# Altium schematic sheet Sheet1.SchDoc
size 1016 x 508 mm; SheetNumber: 1; SheetTotal: 1
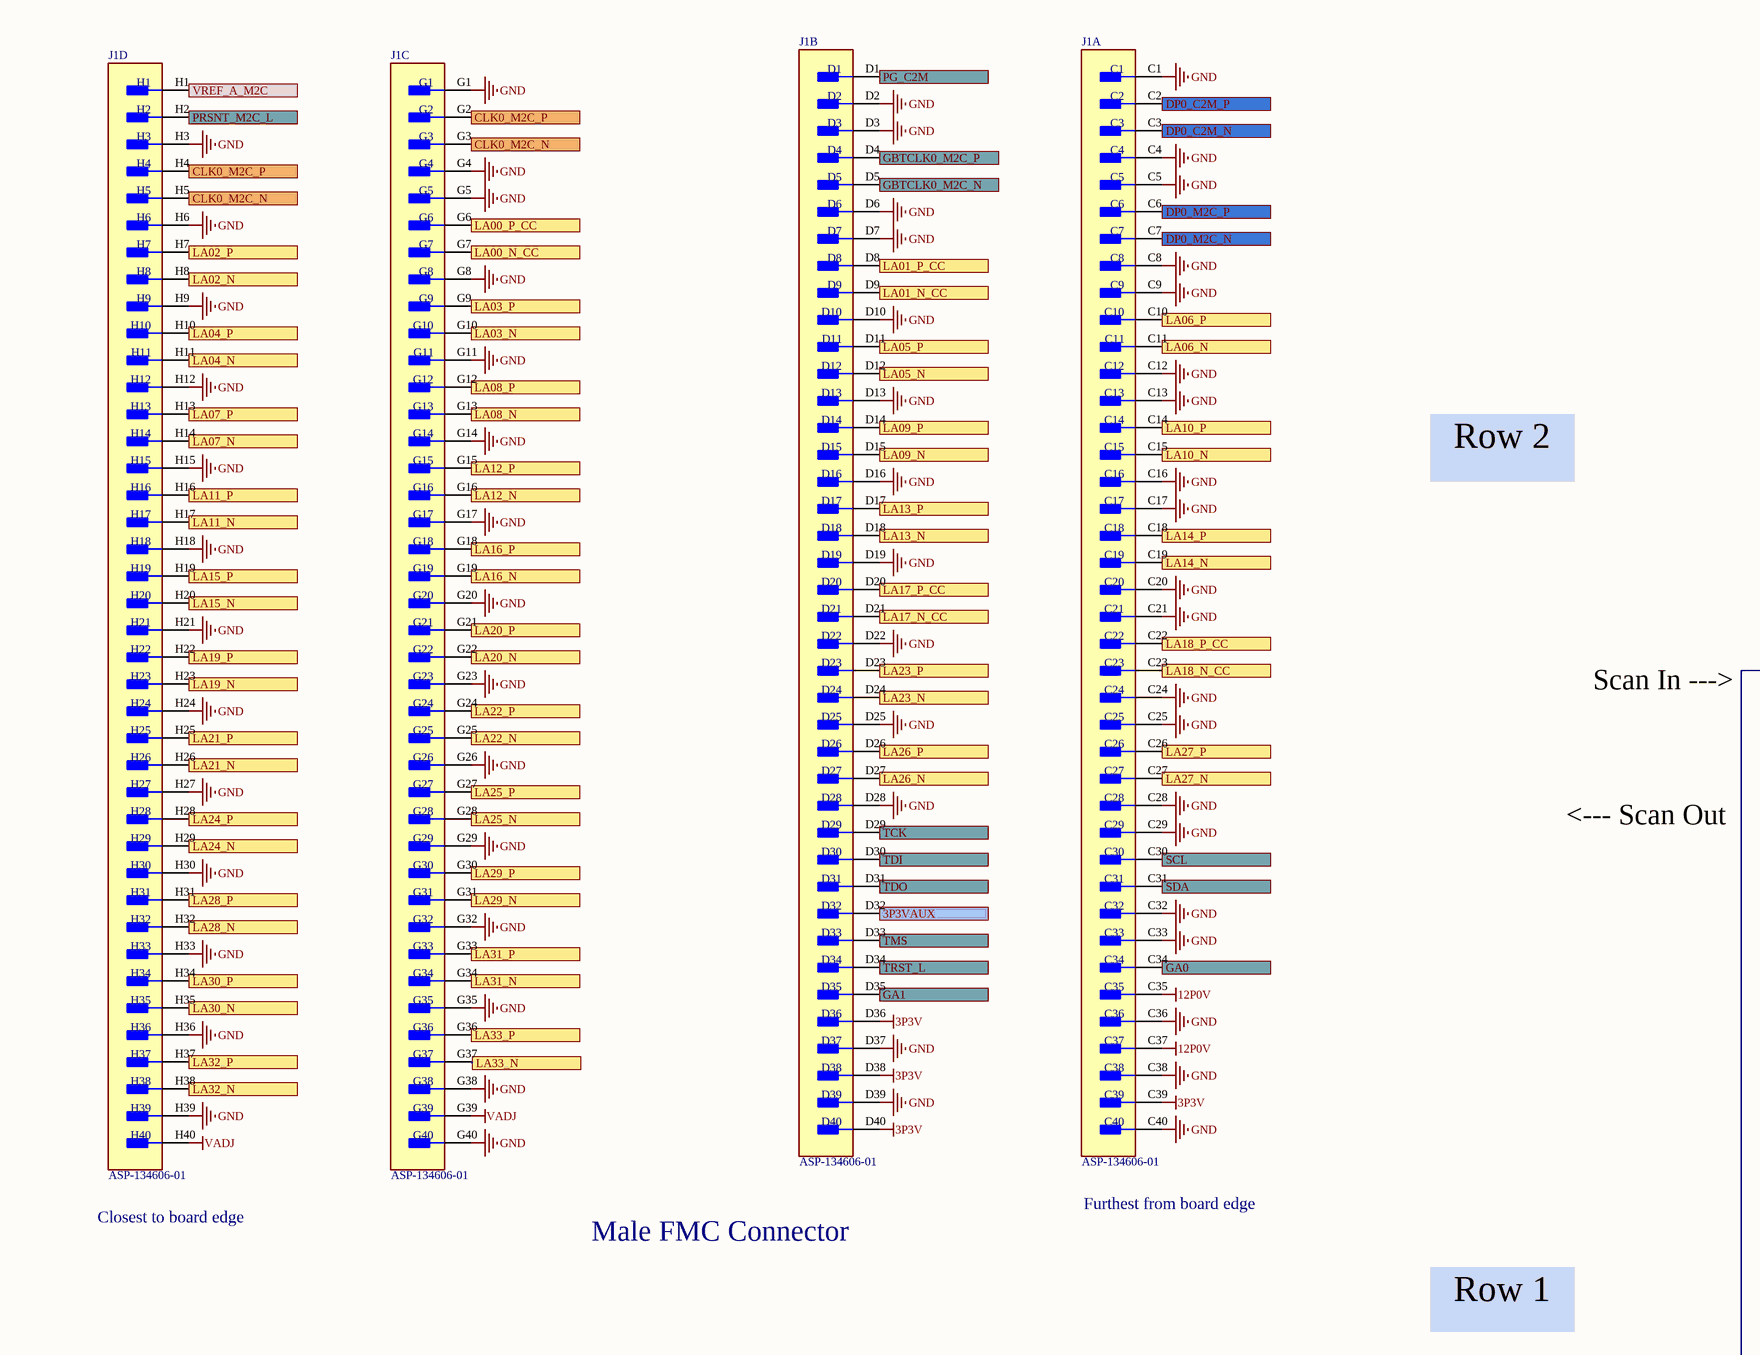
[diagram p0: Sheet1.SchDoc, top left]
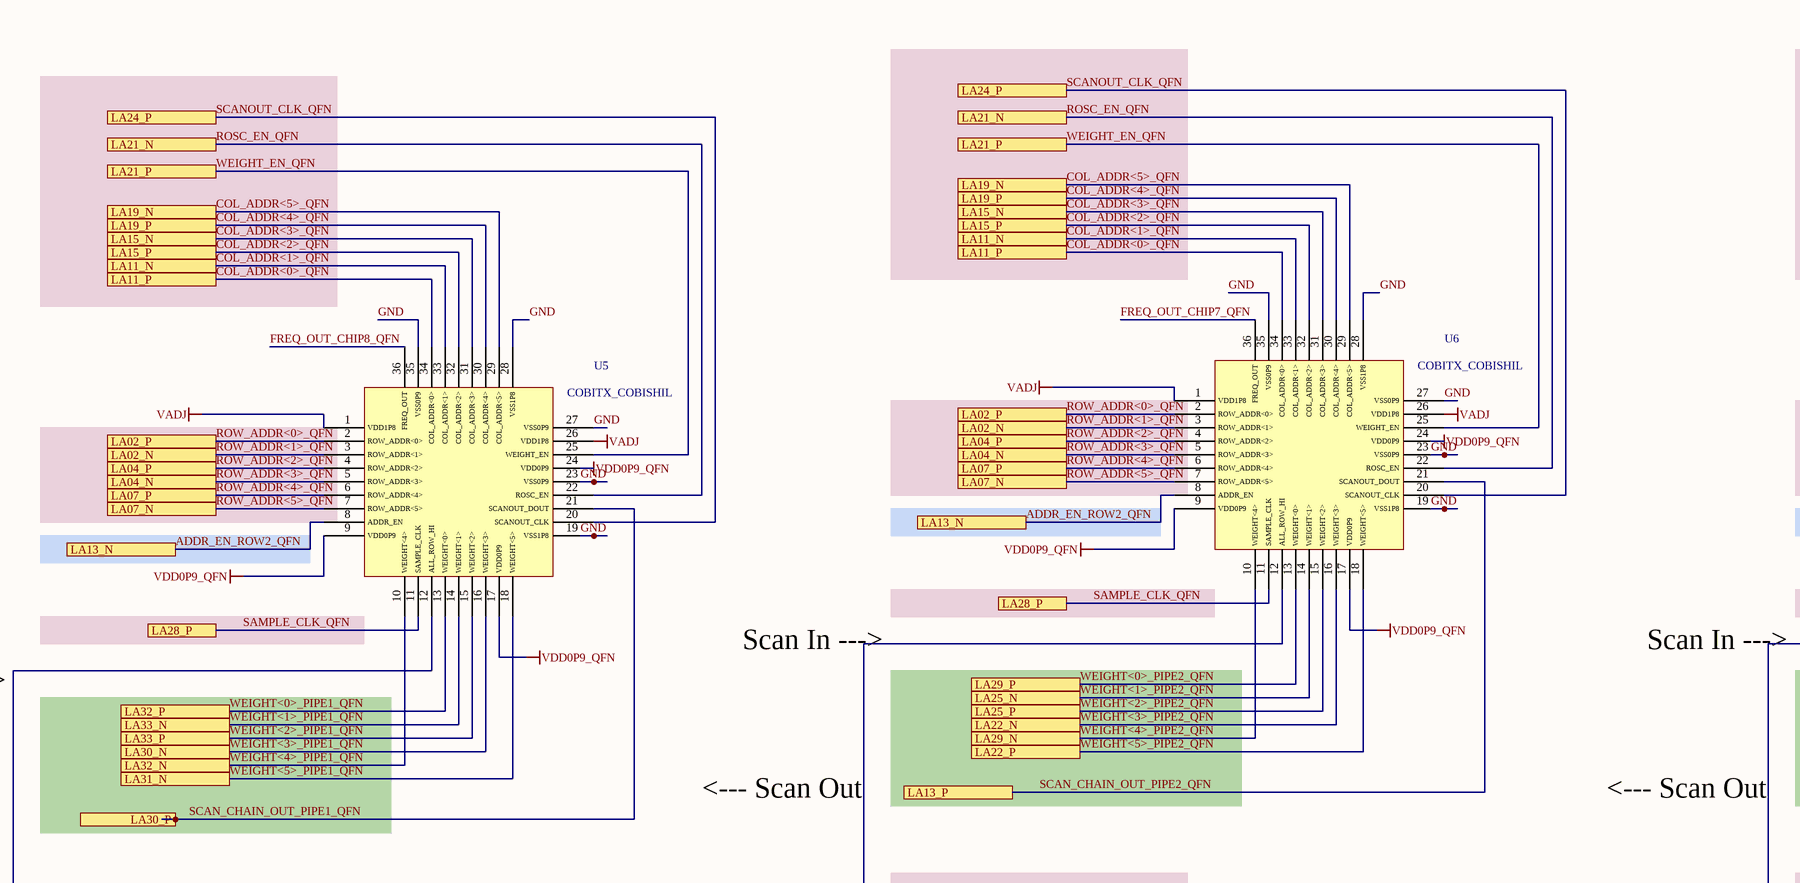
[diagram p1: Sheet1.SchDoc, top middle]
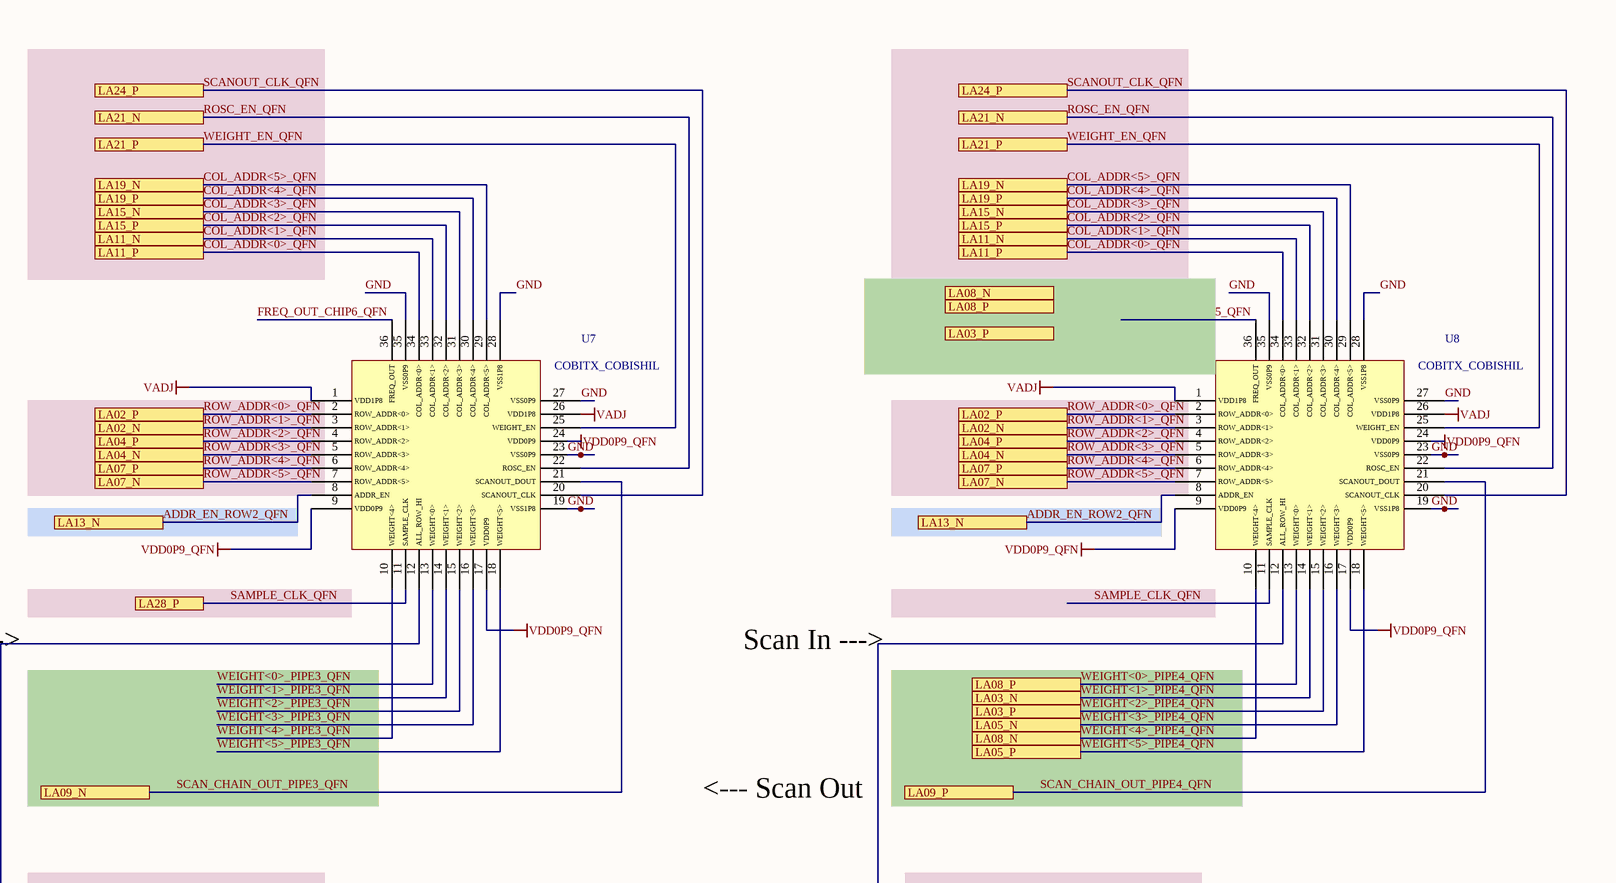
[diagram p2: Sheet1.SchDoc, top right]
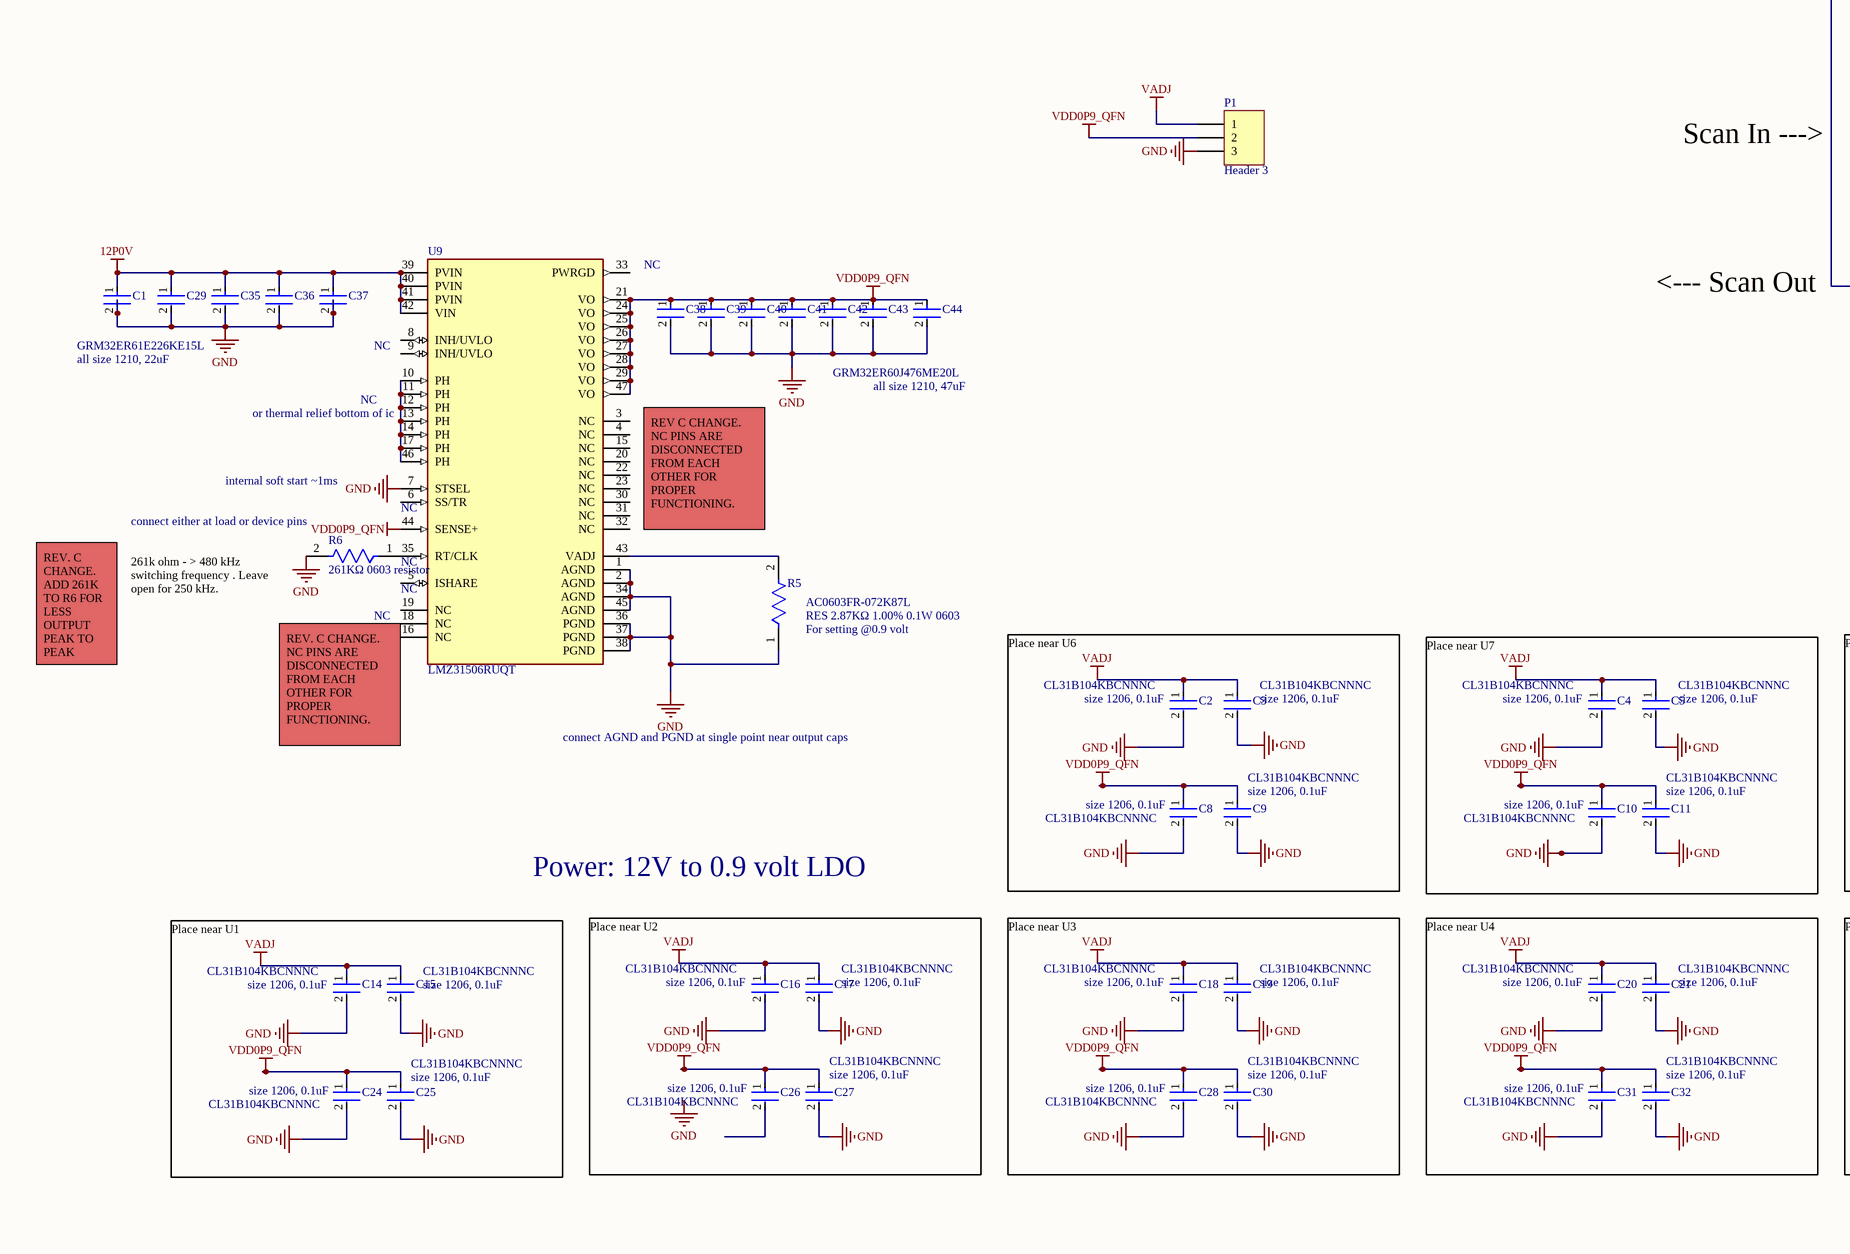
[diagram p3: Sheet1.SchDoc, bottom left]
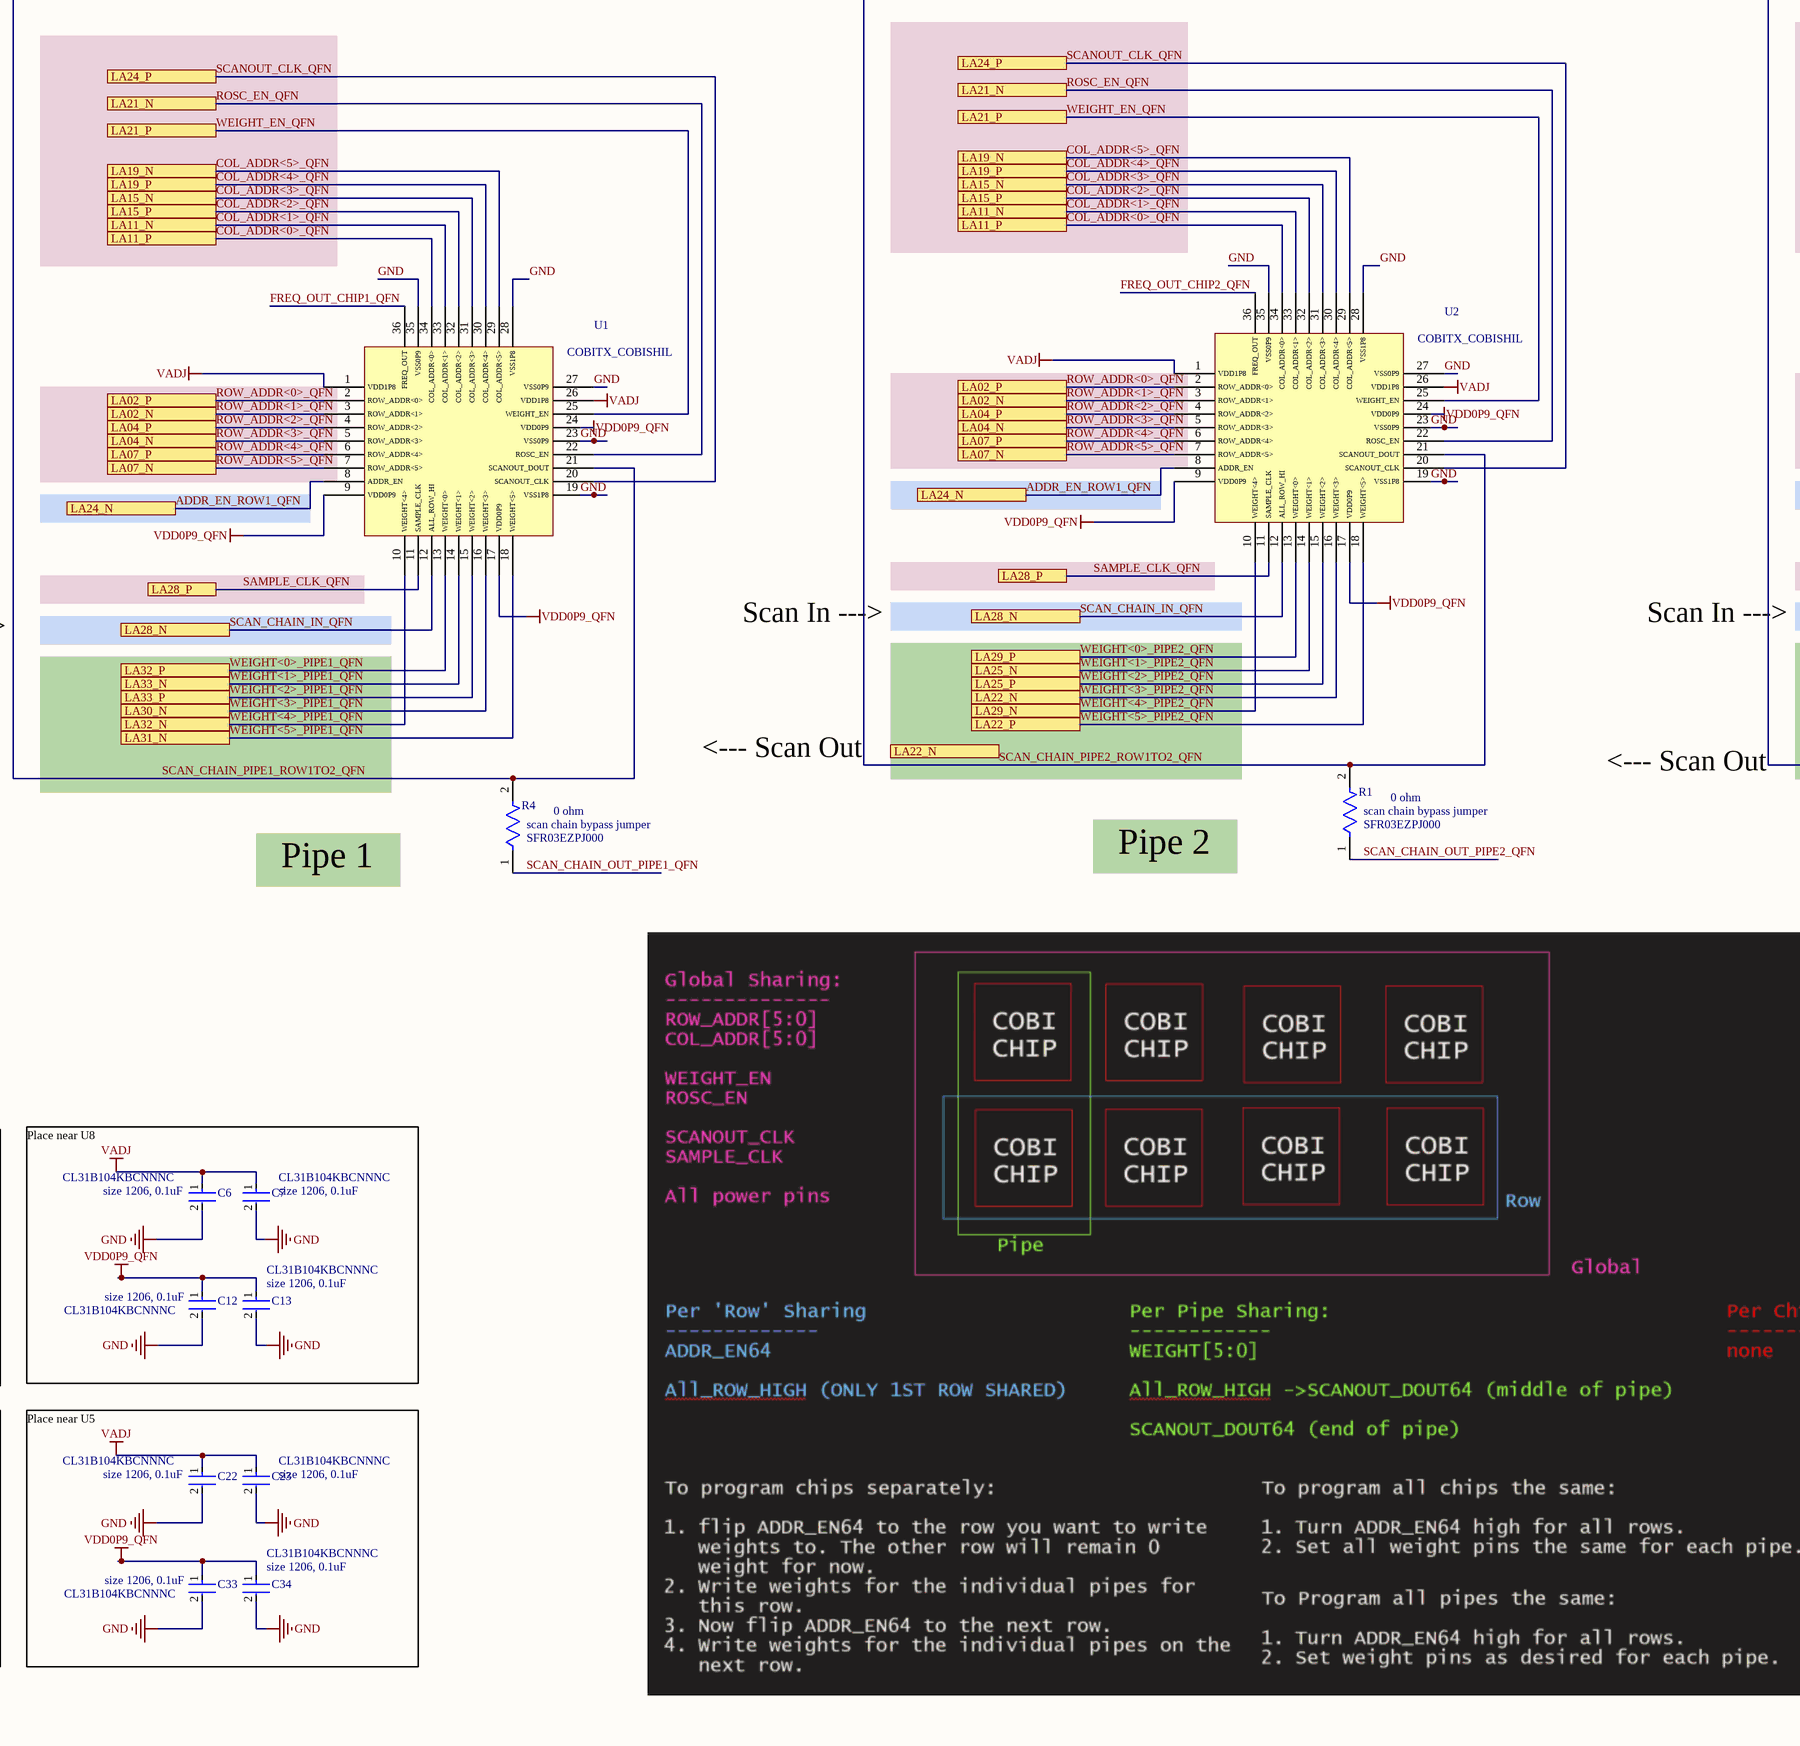
[diagram p4: Sheet1.SchDoc, bottom middle]
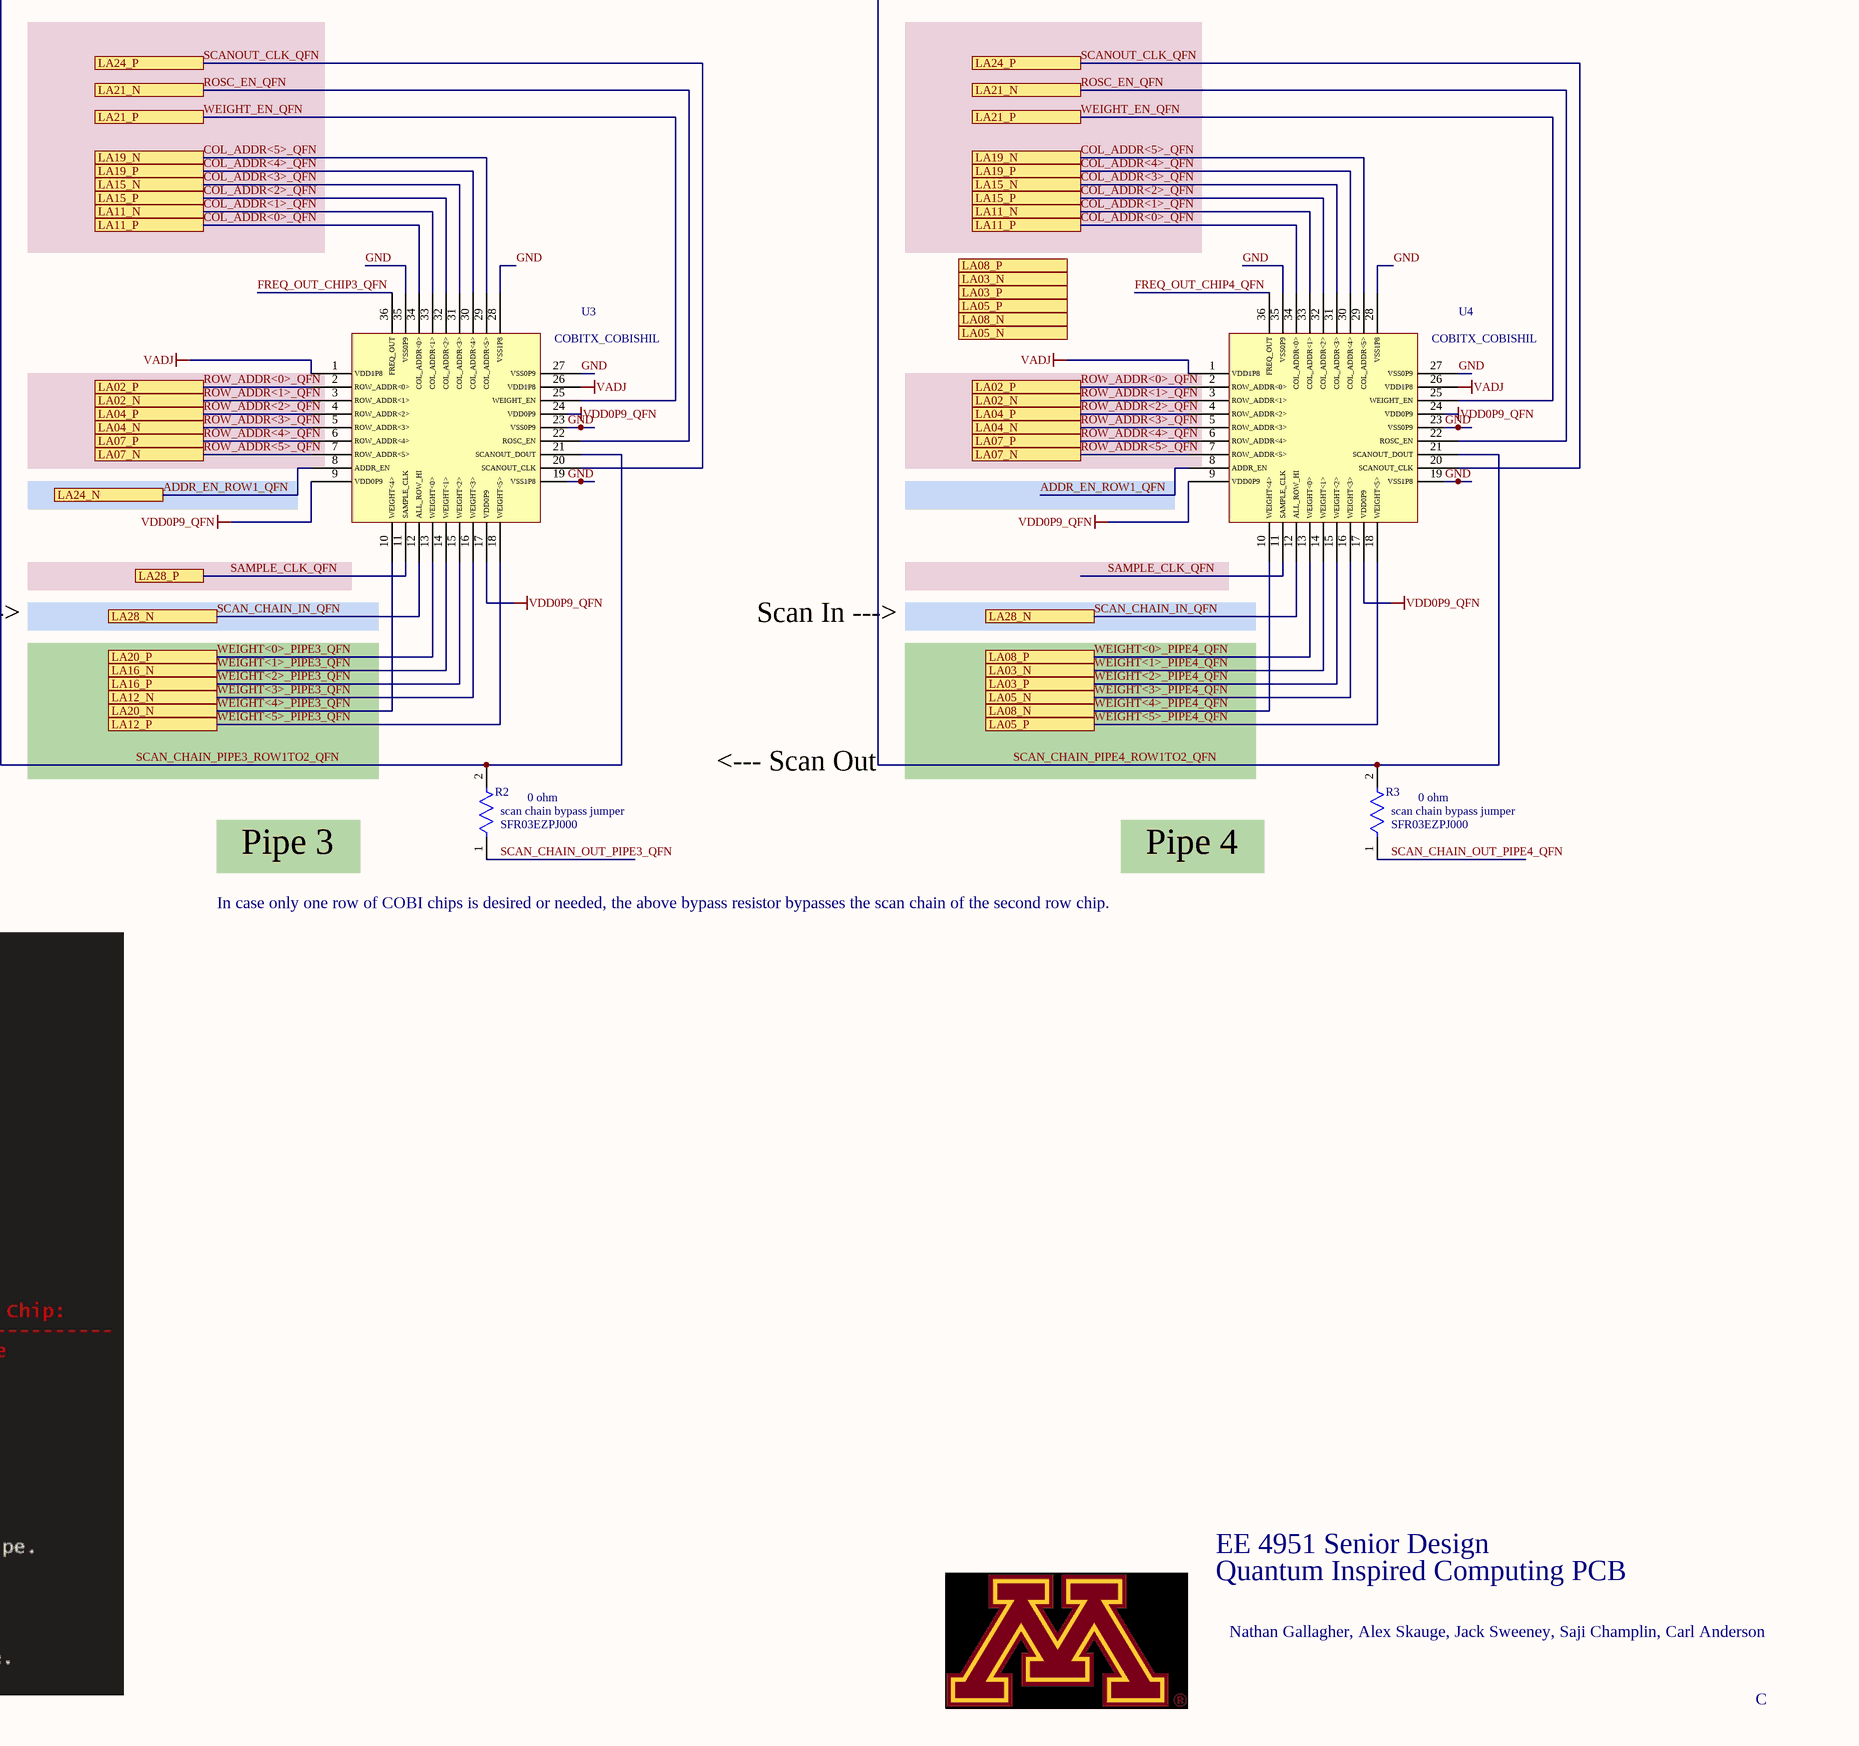
[diagram p5: Sheet1.SchDoc, bottom right]

## Parts
C1  GRM32ER61E226KE15L  [FP-GRM32-MFG]
C2  12061C104KAZ2A  [FP-1206-L_3_2_0_2-W_1_6_0-MFG]  (value not drawn)
C3  12061C104KAZ2A  [FP-1206-L_3_2_0_2-W_1_6_0-MFG]  (value not drawn)
C4  12061C104KAZ2A  [FP-1206-L_3_2_0_2-W_1_6_0-MFG]  (value not drawn)
C5  12061C104KAZ2A  [FP-1206-L_3_2_0_2-W_1_6_0-MFG]  (value not drawn)
C6  12061C104KAZ2A  [FP-1206-L_3_2_0_2-W_1_6_0-MFG]  (value not drawn)
C7  12061C104KAZ2A  [FP-1206-L_3_2_0_2-W_1_6_0-MFG]  (value not drawn)
C8  12061C104KAZ2A  [FP-1206-L_3_2_0_2-W_1_6_0-MFG]  (value not drawn)
C9  12061C104KAZ2A  [FP-1206-L_3_2_0_2-W_1_6_0-MFG]  (value not drawn)
C10  12061C104KAZ2A  [FP-1206-L_3_2_0_2-W_1_6_0-MFG]  (value not drawn)
C11  12061C104KAZ2A  [FP-1206-L_3_2_0_2-W_1_6_0-MFG]  (value not drawn)
C12  12061C104KAZ2A  [FP-1206-L_3_2_0_2-W_1_6_0-MFG]  (value not drawn)
C13  12061C104KAZ2A  [FP-1206-L_3_2_0_2-W_1_6_0-MFG]  (value not drawn)
C14  12061C104KAZ2A  [FP-1206-L_3_2_0_2-W_1_6_0-MFG]  (value not drawn)
C15  12061C104KAZ2A  [FP-1206-L_3_2_0_2-W_1_6_0-MFG]  (value not drawn)
C16  12061C104KAZ2A  [FP-1206-L_3_2_0_2-W_1_6_0-MFG]  (value not drawn)
C17  12061C104KAZ2A  [FP-1206-L_3_2_0_2-W_1_6_0-MFG]  (value not drawn)
C18  12061C104KAZ2A  [FP-1206-L_3_2_0_2-W_1_6_0-MFG]  (value not drawn)
C19  12061C104KAZ2A  [FP-1206-L_3_2_0_2-W_1_6_0-MFG]  (value not drawn)
C20  12061C104KAZ2A  [FP-1206-L_3_2_0_2-W_1_6_0-MFG]  (value not drawn)
C21  12061C104KAZ2A  [FP-1206-L_3_2_0_2-W_1_6_0-MFG]  (value not drawn)
C22  12061C104KAZ2A  [FP-1206-L_3_2_0_2-W_1_6_0-MFG]  (value not drawn)
C23  12061C104KAZ2A  [FP-1206-L_3_2_0_2-W_1_6_0-MFG]  (value not drawn)
C24  12061C104KAZ2A  [FP-1206-L_3_2_0_2-W_1_6_0-MFG]  (value not drawn)
C25  12061C104KAZ2A  [FP-1206-L_3_2_0_2-W_1_6_0-MFG]  (value not drawn)
C26  12061C104KAZ2A  [FP-1206-L_3_2_0_2-W_1_6_0-MFG]  (value not drawn)
C27  12061C104KAZ2A  [FP-1206-L_3_2_0_2-W_1_6_0-MFG]  (value not drawn)
C28  12061C104KAZ2A  [FP-1206-L_3_2_0_2-W_1_6_0-MFG]  (value not drawn)
C29  GRM32ER61E226KE15L  [FP-GRM32-MFG]  (value not drawn)
C30  12061C104KAZ2A  [FP-1206-L_3_2_0_2-W_1_6_0-MFG]  (value not drawn)
C31  12061C104KAZ2A  [FP-1206-L_3_2_0_2-W_1_6_0-MFG]  (value not drawn)
C32  12061C104KAZ2A  [FP-1206-L_3_2_0_2-W_1_6_0-MFG]  (value not drawn)
C33  12061C104KAZ2A  [FP-1206-L_3_2_0_2-W_1_6_0-MFG]  (value not drawn)
C34  12061C104KAZ2A  [FP-1206-L_3_2_0_2-W_1_6_0-MFG]  (value not drawn)
C35  GRM32ER61E226KE15L  [FP-GRM32-MFG]  (value not drawn)
C36  GRM32ER61E226KE15L  [FP-GRM32-MFG]  (value not drawn)
C37  GRM32ER61E226KE15L  [FP-GRM32-MFG]  (value not drawn)
C38  GRM32ER60J476ME20L  [FP-GRM32E-0_3-0_2-MFG]  (value not drawn)
C39  GRM32ER60J476ME20L  [FP-GRM32E-0_3-0_2-MFG]  (value not drawn)
C40  GRM32ER60J476ME20L  [FP-GRM32E-0_3-0_2-MFG]  (value not drawn)
C41  GRM32ER60J476ME20L  [FP-GRM32E-0_3-0_2-MFG]  (value not drawn)
C42  GRM32ER60J476ME20L  [FP-GRM32E-0_3-0_2-MFG]  (value not drawn)
C43  GRM32ER60J476ME20L  [FP-GRM32E-0_3-0_2-MFG]  (value not drawn)
C44  GRM32ER60J476ME20L  [FP-GRM32E-0_3-0_2-MFG]
J1  ASP-134606-01  [FP-ASP-134606-01-MFG]  (parts A,B,C,D of 4)
P1  Header 3  [HDR1X3]
R1  0 ohm  [FP-RK73Z1J-MFG]
R2  0 ohm  [FP-RK73Z1J-MFG]
R3  0 ohm  [FP-RK73Z1J-MFG]
R4  0 ohm  [FP-RK73Z1J-MFG]
R5  AC0603FR-072K87L  [FP-AC0603-IPC_A]
R6  261KΩ 0603 resistor  [FP-AC0603-IPC_A]
U1  COBITX_COBISHIL  [QFN36 - duplicate]
U2  COBITX_COBISHIL  [QFN36 - duplicate]
U3  COBITX_COBISHIL  [QFN36 - duplicate]
U4  COBITX_COBISHIL  [QFN36 - duplicate]
U5  COBITX_COBISHIL  [QFN36 - duplicate]
U6  COBITX_COBISHIL  [QFN36 - duplicate]
U7  COBITX_COBISHIL  [QFN36 - duplicate]
U8  COBITX_COBISHIL  [QFN36 - duplicate]
U9  LMZ31506RUQT  [FP-RUQ0047A-MFG]

## Ports
3P3VAUX, CLK0_M2C_N, CLK0_M2C_P, DP0_C2M_N, DP0_C2M_P, DP0_M2C_N, DP0_M2C_P, GA0, GA1, GBTCLK0_M2C_N, GBTCLK0_M2C_P, LA00_N_CC, LA00_P_CC, LA01_N_CC, LA01_P_CC, LA02_N, LA02_P, LA03_N, LA03_P, LA04_N, LA04_P, LA05_N, LA05_P, LA06_N, LA06_P, LA07_N, LA07_P, LA08_N, LA08_P, LA09_N, LA09_P, LA10_N, LA10_P, LA11_N, LA11_P, LA12_N, LA12_P, LA13_N, LA13_P, LA14_N, LA14_P, LA15_N, LA15_P, LA16_N, LA16_P, LA17_N_CC, LA17_P_CC, LA18_N_CC, LA18_P_CC, LA19_N, LA19_P, LA20_N, LA20_P, LA21_N, LA21_P, LA22_N, LA22_P, LA23_N, LA23_P, LA24_N, LA24_P, LA25_N, LA25_P, LA26_N, LA26_P, LA27_N, LA27_P, LA28_N, LA28_P, LA29_N, LA29_P, LA30_N, LA30_P, LA31_N, LA31_P, LA32_N, LA32_P, LA33_N, LA33_P, PG_C2M, PRSNT_M2C_L, SCL, SDA, TCK, TDI, TDO, TMS, TRST_L, VREF_A_M2C

## Nets
3P3V: J1.C39 J1.D36 J1.D38 J1.D40
12P0V: C1.1 C29.1 C35.1 C36.1 C37.1 J1.C35 J1.C37 U9.39(PVIN) U9.40(PVIN) U9.41(PVIN) U9.42(VIN)
GND: C1.2 C2.2 C3.2 C4.2 C5.2 C6.2 C7.2 C8.2 C9.2 C10.2 C11.2 C12.2 C13.2 C14.2 C15.2 C16.2 C17.2 C18.2 C19.2 C20.2 C21.2 C22.2 C23.2 C24.2 C25.2 C27.2 C28.2 C29.2 C30.2 C31.2 C32.2 C33.2 C34.2 C35.2 C36.2 C37.2 C38.2 C39.2 C40.2 C41.2 C42.2 C43.2 C44.2 J1.C1 J1.C4 J1.C5 J1.C8 J1.C9 J1.C12 J1.C13 J1.C16 J1.C17 J1.C20 J1.C21 J1.C24 J1.C25 J1.C28 J1.C29 J1.C32 J1.C33 J1.C36 J1.C38 J1.C40 J1.D2 J1.D3 J1.D6 J1.D7 J1.D10 J1.D13 J1.D16 J1.D19 J1.D22 J1.D25 J1.D28 J1.D37 J1.D39 J1.G1 J1.G4 J1.G5 J1.G8 J1.G11 J1.G14 J1.G17 J1.G20 J1.G23 J1.G26 J1.G29 J1.G32 J1.G35 J1.G38 J1.G40 J1.H3 J1.H6 J1.H9 J1.H12 J1.H15 J1.H18 J1.H21 J1.H24 J1.H27 J1.H30 J1.H33 J1.H36 J1.H39 P1.3 R5.1 R6.2 U1.19(VSS1P8) U1.23(VSS0P9) U1.27(VSS0P9) U1.28(VSS1P8) U1.35(VSS0P9) U2.19(VSS1P8) U2.23(VSS0P9) U2.27(VSS0P9) U2.28(VSS1P8) U2.35(VSS0P9) U3.19(VSS1P8) U3.23(VSS0P9) U3.27(VSS0P9) U3.28(VSS1P8) U3.35(VSS0P9) U4.19(VSS1P8) U4.23(VSS0P9) U4.27(VSS0P9) U4.28(VSS1P8) U4.35(VSS0P9) U5.19(VSS1P8) U5.23(VSS0P9) U5.27(VSS0P9) U5.28(VSS1P8) U5.35(VSS0P9) U6.19(VSS1P8) U6.23(VSS0P9) U6.27(VSS0P9) U6.28(VSS1P8) U6.35(VSS0P9) U7.19(VSS1P8) U7.23(VSS0P9) U7.27(VSS0P9) U7.28(VSS1P8) U7.35(VSS0P9) U8.19(VSS1P8) U8.23(VSS0P9) U8.27(VSS0P9) U8.28(VSS1P8) U8.35(VSS0P9) U9.1(AGND) U9.2(AGND) U9.7(STSEL) U9.34(AGND) U9.36(PGND) U9.37(PGND) U9.38(PGND) U9.45(AGND)
VADJ: C2.1 C3.1 C4.1 C5.1 C6.1 C7.1 C14.1 C15.1 C16.1 C17.1 C18.1 C19.1 C20.1 C21.1 C22.1 C23.1 J1.G39 J1.H40 P1.1 U1.1(VDD1P8) U1.26(VDD1P8) U2.1(VDD1P8) U2.26(VDD1P8) U3.1(VDD1P8) U3.26(VDD1P8) U4.1(VDD1P8) U4.26(VDD1P8) U5.1(VDD1P8) U5.26(VDD1P8) U6.1(VDD1P8) U6.26(VDD1P8) U7.1(VDD1P8) U7.26(VDD1P8) U8.1(VDD1P8) U8.26(VDD1P8)
VDD0P9_QFN: C8.1 C9.1 C10.1 C11.1 C12.1 C13.1 C24.1 C25.1 C26.1 C27.1 C28.1 C30.1 C31.1 C32.1 C33.1 C34.1 C38.1 C39.1 C40.1 C41.1 C42.1 C43.1 C44.1 P1.2 U1.9(VDD0P9) U1.17(VDD0P9) U1.24(VDD0P9) U2.9(VDD0P9) U2.17(VDD0P9) U2.24(VDD0P9) U3.9(VDD0P9) U3.17(VDD0P9) U3.24(VDD0P9) U4.9(VDD0P9) U4.17(VDD0P9) U4.24(VDD0P9) U5.9(VDD0P9) U5.17(VDD0P9) U5.24(VDD0P9) U6.9(VDD0P9) U6.17(VDD0P9) U6.24(VDD0P9) U7.9(VDD0P9) U7.17(VDD0P9) U7.24(VDD0P9) U8.9(VDD0P9) U8.17(VDD0P9) U8.24(VDD0P9) U9.21(VO) U9.24(VO) U9.25(VO) U9.26(VO) U9.27(VO) U9.28(VO) U9.29(VO) U9.44(SENSE+) U9.47(VO)
3P3VAUX: J1.D32 ; port 3P3VAUX
ADDR_EN_ROW1_QFN: J1.H29 U1.8(ADDR_EN) U2.8(ADDR_EN) U3.8(ADDR_EN) U4.8(ADDR_EN) ; port LA24_N
ADDR_EN_ROW2_QFN: J1.D18 U5.8(ADDR_EN) U6.8(ADDR_EN) U7.8(ADDR_EN) U8.8(ADDR_EN) ; port LA13_N
CLK0_M2C_N: J1.G3 J1.H5 ; port CLK0_M2C_N
CLK0_M2C_P: J1.G2 J1.H4 ; port CLK0_M2C_P
COL_ADDR<0>_QFN: J1.H16 U1.34(COL_ADDR<0>) U2.34(COL_ADDR<0>) U3.34(COL_ADDR<0>) U4.34(COL_ADDR<0>) U5.34(COL_ADDR<0>) U6.34(COL_ADDR<0>) U7.34(COL_ADDR<0>) U8.34(COL_ADDR<0>) ; port LA11_P
COL_ADDR<1>_QFN: J1.H17 U1.33(COL_ADDR<1>) U2.33(COL_ADDR<1>) U3.33(COL_ADDR<1>) U4.33(COL_ADDR<1>) U5.33(COL_ADDR<1>) U6.33(COL_ADDR<1>) U7.33(COL_ADDR<1>) U8.33(COL_ADDR<1>) ; port LA11_N
COL_ADDR<2>_QFN: J1.H19 U1.32(COL_ADDR<2>) U2.32(COL_ADDR<2>) U3.32(COL_ADDR<2>) U4.32(COL_ADDR<2>) U5.32(COL_ADDR<2>) U6.32(COL_ADDR<2>) U7.32(COL_ADDR<2>) U8.32(COL_ADDR<2>) ; port LA15_P
COL_ADDR<3>_QFN: J1.H20 U1.31(COL_ADDR<3>) U2.31(COL_ADDR<3>) U3.31(COL_ADDR<3>) U4.31(COL_ADDR<3>) U5.31(COL_ADDR<3>) U6.31(COL_ADDR<3>) U7.31(COL_ADDR<3>) U8.31(COL_ADDR<3>) ; port LA15_N
COL_ADDR<4>_QFN: J1.H22 U1.30(COL_ADDR<4>) U2.30(COL_ADDR<4>) U3.30(COL_ADDR<4>) U4.30(COL_ADDR<4>) U5.30(COL_ADDR<4>) U6.30(COL_ADDR<4>) U7.30(COL_ADDR<4>) U8.30(COL_ADDR<4>) ; port LA19_P
COL_ADDR<5>_QFN: J1.H23 U1.29(COL_ADDR<5>) U2.29(COL_ADDR<5>) U3.29(COL_ADDR<5>) U4.29(COL_ADDR<5>) U5.29(COL_ADDR<5>) U6.29(COL_ADDR<5>) U7.29(COL_ADDR<5>) U8.29(COL_ADDR<5>) ; port LA19_N
DP0_C2M_N: J1.C3 ; port DP0_C2M_N
DP0_C2M_P: J1.C2 ; port DP0_C2M_P
DP0_M2C_N: J1.C7 ; port DP0_M2C_N
DP0_M2C_P: J1.C6 ; port DP0_M2C_P
FREQ_OUT_CHIP1_QFN: U1.36(FREQ_OUT)
FREQ_OUT_CHIP2_QFN: U2.36(FREQ_OUT)
FREQ_OUT_CHIP3_QFN: U3.36(FREQ_OUT)
FREQ_OUT_CHIP4_QFN: U4.36(FREQ_OUT)
FREQ_OUT_CHIP5_QFN: U8.36(FREQ_OUT)
FREQ_OUT_CHIP6_QFN: U7.36(FREQ_OUT)
FREQ_OUT_CHIP7_QFN: U6.36(FREQ_OUT)
FREQ_OUT_CHIP8_QFN: U5.36(FREQ_OUT)
GA0: J1.C34 ; port GA0
GA1: J1.D35 ; port GA1
GBTCLK0_M2C_N: J1.D5 ; port GBTCLK0_M2C_N
GBTCLK0_M2C_P: J1.D4 ; port GBTCLK0_M2C_P
LA00_N_CC: J1.G7 ; port LA00_N_CC
LA00_P_CC: J1.G6 ; port LA00_P_CC
LA01_N_CC: J1.D9 ; port LA01_N_CC
LA01_P_CC: J1.D8 ; port LA01_P_CC
LA06_N: J1.C11 ; port LA06_N
LA06_P: J1.C10 ; port LA06_P
LA10_N: J1.C15 ; port LA10_N
LA10_P: J1.C14 ; port LA10_P
LA14_N: J1.C19 ; port LA14_N
LA14_P: J1.C18 ; port LA14_P
LA17_N_CC: J1.D21 ; port LA17_N_CC
LA17_P_CC: J1.D20 ; port LA17_P_CC
LA18_N_CC: J1.C23 ; port LA18_N_CC
LA18_P_CC: J1.C22 ; port LA18_P_CC
LA23_N: J1.D24 ; port LA23_N
LA23_P: J1.D23 ; port LA23_P
LA26_N: J1.D27 ; port LA26_N
LA26_P: J1.D26 ; port LA26_P
LA27_N: J1.C27 ; port LA27_N
LA27_P: J1.C26 ; port LA27_P
LA31_P: J1.G33 ; port LA31_P
PG_C2M: J1.D1 ; port PG_C2M
PRSNT_M2C_L: J1.H2 ; port PRSNT_M2C_L
ROSC_EN_QFN: J1.H26 U1.22(ROSC_EN) U2.22(ROSC_EN) U3.22(ROSC_EN) U4.22(ROSC_EN) U5.22(ROSC_EN) U6.22(ROSC_EN) U7.22(ROSC_EN) U8.22(ROSC_EN) ; port LA21_N
ROW_ADDR<0>_QFN: J1.H7 U1.2(ROW_ADDR<0>) U2.2(ROW_ADDR<0>) U3.2(ROW_ADDR<0>) U4.2(ROW_ADDR<0>) U5.2(ROW_ADDR<0>) U6.2(ROW_ADDR<0>) U7.2(ROW_ADDR<0>) U8.2(ROW_ADDR<0>) ; port LA02_P
ROW_ADDR<1>_QFN: J1.H8 U1.3(ROW_ADDR<1>) U2.3(ROW_ADDR<1>) U3.3(ROW_ADDR<1>) U4.3(ROW_ADDR<1>) U5.3(ROW_ADDR<1>) U6.3(ROW_ADDR<1>) U7.3(ROW_ADDR<1>) U8.3(ROW_ADDR<1>) ; port LA02_N
ROW_ADDR<2>_QFN: J1.H10 U1.4(ROW_ADDR<2>) U2.4(ROW_ADDR<2>) U3.4(ROW_ADDR<2>) U4.4(ROW_ADDR<2>) U5.4(ROW_ADDR<2>) U6.4(ROW_ADDR<2>) U7.4(ROW_ADDR<2>) U8.4(ROW_ADDR<2>) ; port LA04_P
ROW_ADDR<3>_QFN: J1.H11 U1.5(ROW_ADDR<3>) U2.5(ROW_ADDR<3>) U3.5(ROW_ADDR<3>) U4.5(ROW_ADDR<3>) U5.5(ROW_ADDR<3>) U6.5(ROW_ADDR<3>) U7.5(ROW_ADDR<3>) U8.5(ROW_ADDR<3>) ; port LA04_N
ROW_ADDR<4>_QFN: J1.H13 U1.6(ROW_ADDR<4>) U2.6(ROW_ADDR<4>) U3.6(ROW_ADDR<4>) U4.6(ROW_ADDR<4>) U5.6(ROW_ADDR<4>) U6.6(ROW_ADDR<4>) U7.6(ROW_ADDR<4>) U8.6(ROW_ADDR<4>) ; port LA07_P
ROW_ADDR<5>_QFN: J1.H14 U1.7(ROW_ADDR<5>) U2.7(ROW_ADDR<5>) U3.7(ROW_ADDR<5>) U4.7(ROW_ADDR<5>) U5.7(ROW_ADDR<5>) U6.7(ROW_ADDR<5>) U7.7(ROW_ADDR<5>) U8.7(ROW_ADDR<5>) ; port LA07_N
SAMPLE_CLK_QFN: J1.H31 U1.11(SAMPLE_CLK) U2.11(SAMPLE_CLK) U3.11(SAMPLE_CLK) U4.11(SAMPLE_CLK) U5.11(SAMPLE_CLK) U6.11(SAMPLE_CLK) U7.11(SAMPLE_CLK) U8.11(SAMPLE_CLK) ; port LA28_P
SCAN_CHAIN_IN_QFN: J1.H32 U1.12(ALL_ROW_HI) U2.12(ALL_ROW_HI) U3.12(ALL_ROW_HI) U4.12(ALL_ROW_HI) ; port LA28_N
SCAN_CHAIN_OUT_PIPE1_QFN: J1.H34 R4.1 U5.21(SCANOUT_DOUT) ; port LA30_P
SCAN_CHAIN_OUT_PIPE2_QFN: J1.D17 R1.1 U6.21(SCANOUT_DOUT) ; port LA13_P
SCAN_CHAIN_OUT_PIPE3_QFN: J1.D15 R2.1 U7.21(SCANOUT_DOUT) ; port LA09_N
SCAN_CHAIN_OUT_PIPE4_QFN: J1.D14 R3.1 U8.21(SCANOUT_DOUT) ; port LA09_P
SCAN_CHAIN_PIPE1_ROW1TO2_QFN: R4.2 U1.21(SCANOUT_DOUT) U5.12(ALL_ROW_HI)
SCAN_CHAIN_PIPE2_ROW1TO2_QFN: R1.2 U2.21(SCANOUT_DOUT) U6.12(ALL_ROW_HI)
SCAN_CHAIN_PIPE3_ROW1TO2_QFN: R2.2 U3.21(SCANOUT_DOUT) U7.12(ALL_ROW_HI)
SCAN_CHAIN_PIPE4_ROW1TO2_QFN: R3.2 U4.21(SCANOUT_DOUT) U8.12(ALL_ROW_HI)
SCANOUT_CLK_QFN: J1.H28 U1.20(SCANOUT_CLK) U2.20(SCANOUT_CLK) U3.20(SCANOUT_CLK) U4.20(SCANOUT_CLK) U5.20(SCANOUT_CLK) U6.20(SCANOUT_CLK) U7.20(SCANOUT_CLK) U8.20(SCANOUT_CLK) ; port LA24_P
SCL: J1.C30 ; port SCL
SDA: J1.C31 ; port SDA
TCK: J1.D29 ; port TCK
TDI: J1.D30 ; port TDI
TDO: J1.D31 ; port TDO
TMS: J1.D33 ; port TMS
TRST_L: J1.D34 ; port TRST_L
VREF_A_M2C: J1.H1 ; port VREF_A_M2C
WEIGHT<0>_PIPE1_QFN: J1.H37 U1.13(WEIGHT<0>) U5.13(WEIGHT<0>) ; port LA32_P
WEIGHT<0>_PIPE2_QFN: J1.G30 U2.13(WEIGHT<0>) U6.13(WEIGHT<0>) ; port LA29_P
WEIGHT<0>_PIPE3_QFN: J1.G21 U3.13(WEIGHT<0>) U7.13(WEIGHT<0>) ; port LA20_P
WEIGHT<0>_PIPE4_QFN: J1.G12 U4.13(WEIGHT<0>) U8.13(WEIGHT<0>) ; port LA08_P
WEIGHT<1>_PIPE1_QFN: J1.G37 U1.14(WEIGHT<1>) U5.14(WEIGHT<1>) ; port LA33_N
WEIGHT<1>_PIPE2_QFN: J1.G28 U2.14(WEIGHT<1>) U6.14(WEIGHT<1>) ; port LA25_N
WEIGHT<1>_PIPE3_QFN: J1.G19 U3.14(WEIGHT<1>) U7.14(WEIGHT<1>) ; port LA16_N
WEIGHT<1>_PIPE4_QFN: J1.G10 U4.14(WEIGHT<1>) U8.14(WEIGHT<1>) ; port LA03_N
WEIGHT<2>_PIPE1_QFN: J1.G36 U1.15(WEIGHT<2>) U5.15(WEIGHT<2>) ; port LA33_P
WEIGHT<2>_PIPE2_QFN: J1.G27 U2.15(WEIGHT<2>) U6.15(WEIGHT<2>) ; port LA25_P
WEIGHT<2>_PIPE3_QFN: J1.G18 U3.15(WEIGHT<2>) U7.15(WEIGHT<2>) ; port LA16_P
WEIGHT<2>_PIPE4_QFN: J1.G9 U4.15(WEIGHT<2>) U8.15(WEIGHT<2>) ; port LA03_P
WEIGHT<3>_PIPE1_QFN: J1.H35 U1.16(WEIGHT<3>) U5.16(WEIGHT<3>) ; port LA30_N
WEIGHT<3>_PIPE2_QFN: J1.G25 U2.16(WEIGHT<3>) U6.16(WEIGHT<3>) ; port LA22_N
WEIGHT<3>_PIPE3_QFN: J1.G16 U3.16(WEIGHT<3>) U7.16(WEIGHT<3>) ; port LA12_N
WEIGHT<3>_PIPE4_QFN: J1.D12 U4.16(WEIGHT<3>) U8.16(WEIGHT<3>) ; port LA05_N
WEIGHT<4>_PIPE1_QFN: J1.H38 U1.10(WEIGHT<4>) U5.10(WEIGHT<4>) ; port LA32_N
WEIGHT<4>_PIPE2_QFN: J1.G31 U2.10(WEIGHT<4>) U6.10(WEIGHT<4>) ; port LA29_N
WEIGHT<4>_PIPE3_QFN: J1.G22 U3.10(WEIGHT<4>) U7.10(WEIGHT<4>) ; port LA20_N
WEIGHT<4>_PIPE4_QFN: J1.G13 U4.10(WEIGHT<4>) U8.10(WEIGHT<4>) ; port LA08_N
WEIGHT<5>_PIPE1_QFN: J1.G34 U1.18(WEIGHT<5>) U5.18(WEIGHT<5>) ; port LA31_N
WEIGHT<5>_PIPE2_QFN: J1.G24 U2.18(WEIGHT<5>) U6.18(WEIGHT<5>) ; port LA22_P
WEIGHT<5>_PIPE3_QFN: J1.G15 U3.18(WEIGHT<5>) U7.18(WEIGHT<5>) ; port LA12_P
WEIGHT<5>_PIPE4_QFN: J1.D11 U4.18(WEIGHT<5>) U8.18(WEIGHT<5>) ; port LA05_P
WEIGHT_EN_QFN: J1.H25 U1.25(WEIGHT_EN) U2.25(WEIGHT_EN) U3.25(WEIGHT_EN) U4.25(WEIGHT_EN) U5.25(WEIGHT_EN) U6.25(WEIGHT_EN) U7.25(WEIGHT_EN) U8.25(WEIGHT_EN) ; port LA21_P
NetR5_2: R5.2 U9.43(VADJ)
NetR6_1: R6.1 U9.35(RT/CLK)
NetU9_10: U9.10(PH) U9.11(PH) U9.12(PH) U9.13(PH) U9.14(PH) U9.17(PH) U9.46(PH)

Not connected (* = marked no-connect by the designer): C26 2; U9 3(NC) 4(NC) 5(ISHARE) 6(SS/TR) 8(INH/UVLO) 9(INH/UVLO) 15(NC) 16(NC) 18(NC) 19(NC) 20(NC) 22(NC) 23(NC) 30(NC) 31(NC) 32(NC) 33(PWRGD)

## Notes on the sheet
- Row 2
- Scan In --->
- <--- Scan Out
- Closest to board edge
- Male FMC Connector
- Furthest from board edge
- Row 1
- NC
- all size 1210, 22uF
- (near R4) SFR03EZPJ000
- (near R4) scan chain bypass jumper
- Pipe 2
- (near R1) SFR03EZPJ000
- (near R1) scan chain bypass jumper
- Pipe 3
- (near R2) SFR03EZPJ000
- (near R2) scan chain bypass jumper
- Pipe 4
- (near R3) SFR03EZPJ000
- (near R3) scan chain bypass jumper
- (near U9) or thermal relief bottom of ic
- all size 1210, 47uF
- Pipe 1
- In case only one row of COBI chips is desired or needed, the above bypass resistor bypasses the scan chain of the second row chip.
- internal soft start ~1ms
- (near U9) NC
- (near R6) connect either at load or device pins
- REV C CHANGE. NC PINS ARE DISCONNECTED FROM EACH OTHER FOR PROPER FUNCTIONING.
- 261k ohm - > 480 kHz switching frequency . Leave open for 250 kHz.
- (near R5) For setting @0.9 volt
- (near R5) RES 2.87KΩ 1.00% 0.1W 0603
- REV. C CHANGE. ADD 261K TO R6 FOR LESS OUTPUT PEAK TO PEAK
- (near C2) CL31B104KBCNNNC
- (near C2) size 1206, 0.1uF
- (near C3) size 1206, 0.1uF
- (near C3) CL31B104KBCNNNC
- (near C4) CL31B104KBCNNNC
- (near C4) size 1206, 0.1uF
- (near C5) size 1206, 0.1uF
- (near C5) CL31B104KBCNNNC
- (near C6) CL31B104KBCNNNC
- (near C6) size 1206, 0.1uF
- (near C7) size 1206, 0.1uF
- (near C7) CL31B104KBCNNNC
- (near U9) REV. C CHANGE. NC PINS ARE DISCONNECTED FROM EACH OTHER FOR PROPER FUNCTIONING.
- connect AGND and PGND at single point near output caps
- (near C9) CL31B104KBCNNNC
- (near C11) CL31B104KBCNNNC
- (near C13) CL31B104KBCNNNC
- (near C8) CL31B104KBCNNNC
- (near C8) size 1206, 0.1uF
- (near C9) size 1206, 0.1uF
- (near C10) CL31B104KBCNNNC
- (near C10) size 1206, 0.1uF
- (near C11) size 1206, 0.1uF
- (near C12) CL31B104KBCNNNC
- (near C12) size 1206, 0.1uF
- (near C13) size 1206, 0.1uF
- Power: 12V to 0.9 volt LDO
- Place near U6
- Place near U7
- Place near U8
- (near C14) CL31B104KBCNNNC
- (near C14) size 1206, 0.1uF
- (near C15) size 1206, 0.1uF
- (near C15) CL31B104KBCNNNC
- (near C16) CL31B104KBCNNNC
- (near C16) size 1206, 0.1uF
- (near C17) size 1206, 0.1uF
- (near C17) CL31B104KBCNNNC
- (near C18) CL31B104KBCNNNC
- (near C18) size 1206, 0.1uF
- (near C19) size 1206, 0.1uF
- (near C19) CL31B104KBCNNNC
- (near C20) CL31B104KBCNNNC
- (near C20) size 1206, 0.1uF
- (near C21) size 1206, 0.1uF
- (near C21) CL31B104KBCNNNC
- (near C22) CL31B104KBCNNNC
- (near C22) size 1206, 0.1uF
- (near C23) size 1206, 0.1uF
- (near C23) CL31B104KBCNNNC
- (near C24) CL31B104KBCNNNC
- (near C24) size 1206, 0.1uF
- (near C25) size 1206, 0.1uF
- (near C25) CL31B104KBCNNNC
- (near C26) CL31B104KBCNNNC
- (near C26) size 1206, 0.1uF
- (near C27) size 1206, 0.1uF
- (near C27) CL31B104KBCNNNC
- (near C28) CL31B104KBCNNNC
- (near C28) size 1206, 0.1uF
- (near C30) size 1206, 0.1uF
- (near C30) CL31B104KBCNNNC
- (near C31) CL31B104KBCNNNC
- (near C31) size 1206, 0.1uF
- (near C32) size 1206, 0.1uF
- (near C32) CL31B104KBCNNNC
- (near C33) CL31B104KBCNNNC
- (near C33) size 1206, 0.1uF
- (near C34) size 1206, 0.1uF
- (near C34) CL31B104KBCNNNC
- EE 4951 Senior Design
- Quantum Inspired Computing PCB
- Place near U1
- Place near U2
- Place near U3
- Place near U4
- Place near U5
- Nathan Gallagher, Alex Skauge, Jack Sweeney, Saji Champlin, Carl Anderson
- C
- Labels drawn without touching a wire or pin: GND

## Library data of the parts
C1 C29 C35-C37 = CMP-2000-05458-2: CAP CER 22UF 25V X5R 1210; Manufacturer: Murata Electronics North America; Possible Substitute: GRM32ER61E226KE15K; Other Names: 490-3889-2; Material: Ceramic; Tolerance: 10%; Digikey Description: CAP CER 22UF 25V X5R 1210; Mouser Description: Multilayer Ceramic Capacitors MLCC - SMD/SMT 1210 22uF 25volts X5R 10%; Device Class L2: Capacitors; Height: 2.7mm; Temperature Characteristic: X5R; Category: Cap; RoHS: TRUE; Operating Temperature: -55°C ~ 85°C; Temperature: -55°C to +85°C; Lead Free: Yes; Package: GRM32; Temperature Range High: +85°C; Package / Case: 1210 (3225 Metric); Standard Package: 1,000; Packaging: Cut Tape (CT); Capacitance: 22uF; Thickness (Max): 0.106" (2.70mm); Value: 22uF; Automotive: No; Device Class L1: Passive Components; Voltage - Rated: 25V; Temperature Range Low: -55°C; Size / Dimension: 0.126" L x 0.098" W (3.20mm x 2.50mm); ComponentLink2Description: Datasheet; Device Class L3: Ceramic Capacitors; Temperature Coefficient: X5R; ComponentLink2URL: https://search.murata.co.jp/Ceramy/image/img/A01X/G101/ENG/GRM32ER61E226KE15-01A.pdf; Voltage Rating: 25V; Manufacturer Part Number: GRM32ER61E226KE15L; Octopart: https://octopart.com/grm32er61e226ke15l-murata-197441; Applications: General Purpose; Mounting Type: Surface Mount, MLCC
C2-C28 C30-C34 = CMP-04427-004798-1: General Purpose Ceramic Capacitor, 1206, 100nF, 10%, X7R, 15%, 100V; Features: Soft Termination; Termination: SMD/SMT; Mount: Surface Mount; Tolerance: 10%; Voltage Rating: 100V; Length: 3.2mm; Case/Package: 1206; Case Code (Metric): 3216; RoHS Compliant: Yes; Package Quantity: 1; Max Operating Temperature: 125°C; Voltage Rating (DC): 100V; Min Operating Temperature: -55°C; Number of Pins: 2; Packaging: Tape and Reel; Width: 0.063inch; REACH SVHC: No SVHC; Lead Free: Lead Free; Construction: Flat; Capacitance: 100nF; Radiation Hardening: No; Case Code (Imperial): 1206; Thickness: 0.05inch; Series: FLEXITERM®; Depth: 1.6mm; Dielectric: X7R
C38-C44 = CMP-2000-06360-2: CAP CER 47UF 6.3V X5R 1210; Dielectric Material: Ceramic; Insulation Resistance: 10.6MR; Tolerance: 10%; REACH SVHC: No SVHC; Package Quantity: 1; Radiation Hardening: No; Construction: Flat; Voltage Rating: 6.3V; Min Operating Temperature: -55°C; Packaging: Tape and Reel; RoHS Compliant: Yes; Height: 2.5mm; Case Code (Imperial): 1210; Mount: Surface Mount; Max Operating Temperature: 85°C; Width: 2.5mm; Dielectric: X5R; Length: 3.2mm; Thickness: 0.106inch; Lead Free: Lead Free; Series: GRM; Voltage Rating (DC): 6.3V; Termination: SMD/SMT; Case Code (Metric): 3225; Capacitance: 47uF; Weight: 0.000564oz; Case/Package: 1210; Voltage: 6.3V; Depth: 2.5mm
J1 = CMP-02761-000095-1: CONN ARRAY PLUG 160POS SMD GOLD; Number of Positions: 160; Pitch: 0.05inch; Gender: Male; Number of Contacts: 160; Radiation Hardening: No; Contact Plating: Gold; Package Quantity: 1; Number of Rows: 4; Termination: SMD/SMT; Mount: Surface Mount; REACH SVHC: No SVHC; Packaging: Tape and Reel; Contact Material: Copper Alloy
P1 = Header 3: Header, 3-Pin; LatestRevisionDate: 17-Jul-2002; LatestRevisionNote: Re-released for DXP Platform.; Publisher: Altium Limited
R1-R4 = CMP-2000-01769-2: RES 0 OHM JUMPER 0603; Resistance: 0mR; Power Rating: 1W; Tolerance: 1%; Temperature Coefficient: 400ppm/°C; Width: 0.8mm; Case/Package: 0603; RoHS Compliant: Yes; Min Operating Temperature: -55°C; Length: 1.6mm; Termination: SMD/SMT; Package Quantity: 5000; Packaging: Tape and Reel; Military Standard: Not; Series: RK73Z; Construction: Rectangular; Case Code (Metric): 1608; Resistor Type: Thick Film; Case Code (Imperial): 0603; Lead Free: Lead Free; Max Operating Temperature: 155°C; Depth: 0.8mm; Height: 0.45mm
R5 = CMP-03412-017024-2: RES 2.87KΩ 1.00% 0.1W 0603; Power Rating: 100mW; Voltage Rating: 50V; Temperature Coefficient: 100ppm/°C; Resistance: 2.87kR; Tolerance: 1%; Length: 0.063inch; RoHS Compliant: Yes; Case/Package: 0603; Number of Terminations: 2; Series: AC; Height: 0.022inch; Resistor Type: Thick Film; Max Operating Temperature: 155°C; Max Power Dissipation: 100mW; Features: Moisture Resistant; Case Code (Imperial): 0603; Packaging: Tape and Reel; Weight: 7.1E-05oz; Termination: SMD/SMT; Width: 0.8mm; Min Operating Temperature: -55°C; Case Code (Metric): 1608
R6 = CMP-03412-017024-2: Power Rating: 100mW; Voltage Rating: 50V; Temperature Coefficient: 100ppm/°C; Resistance: 2.87kR; Tolerance: 1%; Length: 0.063inch; RoHS Compliant: Yes; Case/Package: 0603; Number of Terminations: 2; Series: AC; Height: 0.022inch; Resistor Type: Thick Film; Max Operating Temperature: 155°C; Max Power Dissipation: 100mW; Features: Moisture Resistant; Case Code (Imperial): 0603; Packaging: Tape and Reel; Weight: 7.1E-05oz; Termination: SMD/SMT; Width: 0.8mm; Min Operating Temperature: -55°C; Case Code (Metric): 1608
U1-U8 = COBITX_COBISHIL: QFN-36
U9 = CMP-04918-000422-1: DC DC CONVERTER 0.6-5.5V 33W; Max Input Voltage (DC): 14.5V; Efficiency: 95%; Min Output Voltage: 5.5V; Min Input Voltage (DC): 1.6V; Switching Frequency: 780kHz; Max Output Current: 6A; Max Output Voltage: 600mV; Number of Outputs: 1; Operating Supply Current: -1.15uA; Min Supply Voltage: 2.95V; Isolation: Non-Isolated; RoHS Compliant: Yes; Max Input Voltage: 14.5V; Features: UVLO; Output Voltage: 5.5V; Case/Package: QFN; Max Power Dissipation: 33W; Output Current: 6A; Max Operating Temperature: 85°C; Width: 0.35inch; Length: 0.59inch; Radiation Hardening: No; Mount: Surface Mount; Depth: 9.15mm; Voltage - Output 1: 5.5V; Number of Pins: 47; Height: 0.11inch; Packaging: Tape and Reel; Lead Free: Lead Free; Min Operating Temperature: -40°C; Package Quantity: 250; Min Input Voltage: 2.95V; REACH SVHC: No SVHC